# EAGLE design Laser_Array_Temp_Low_BRD_V2.3 (EAGLE 7.7.0)
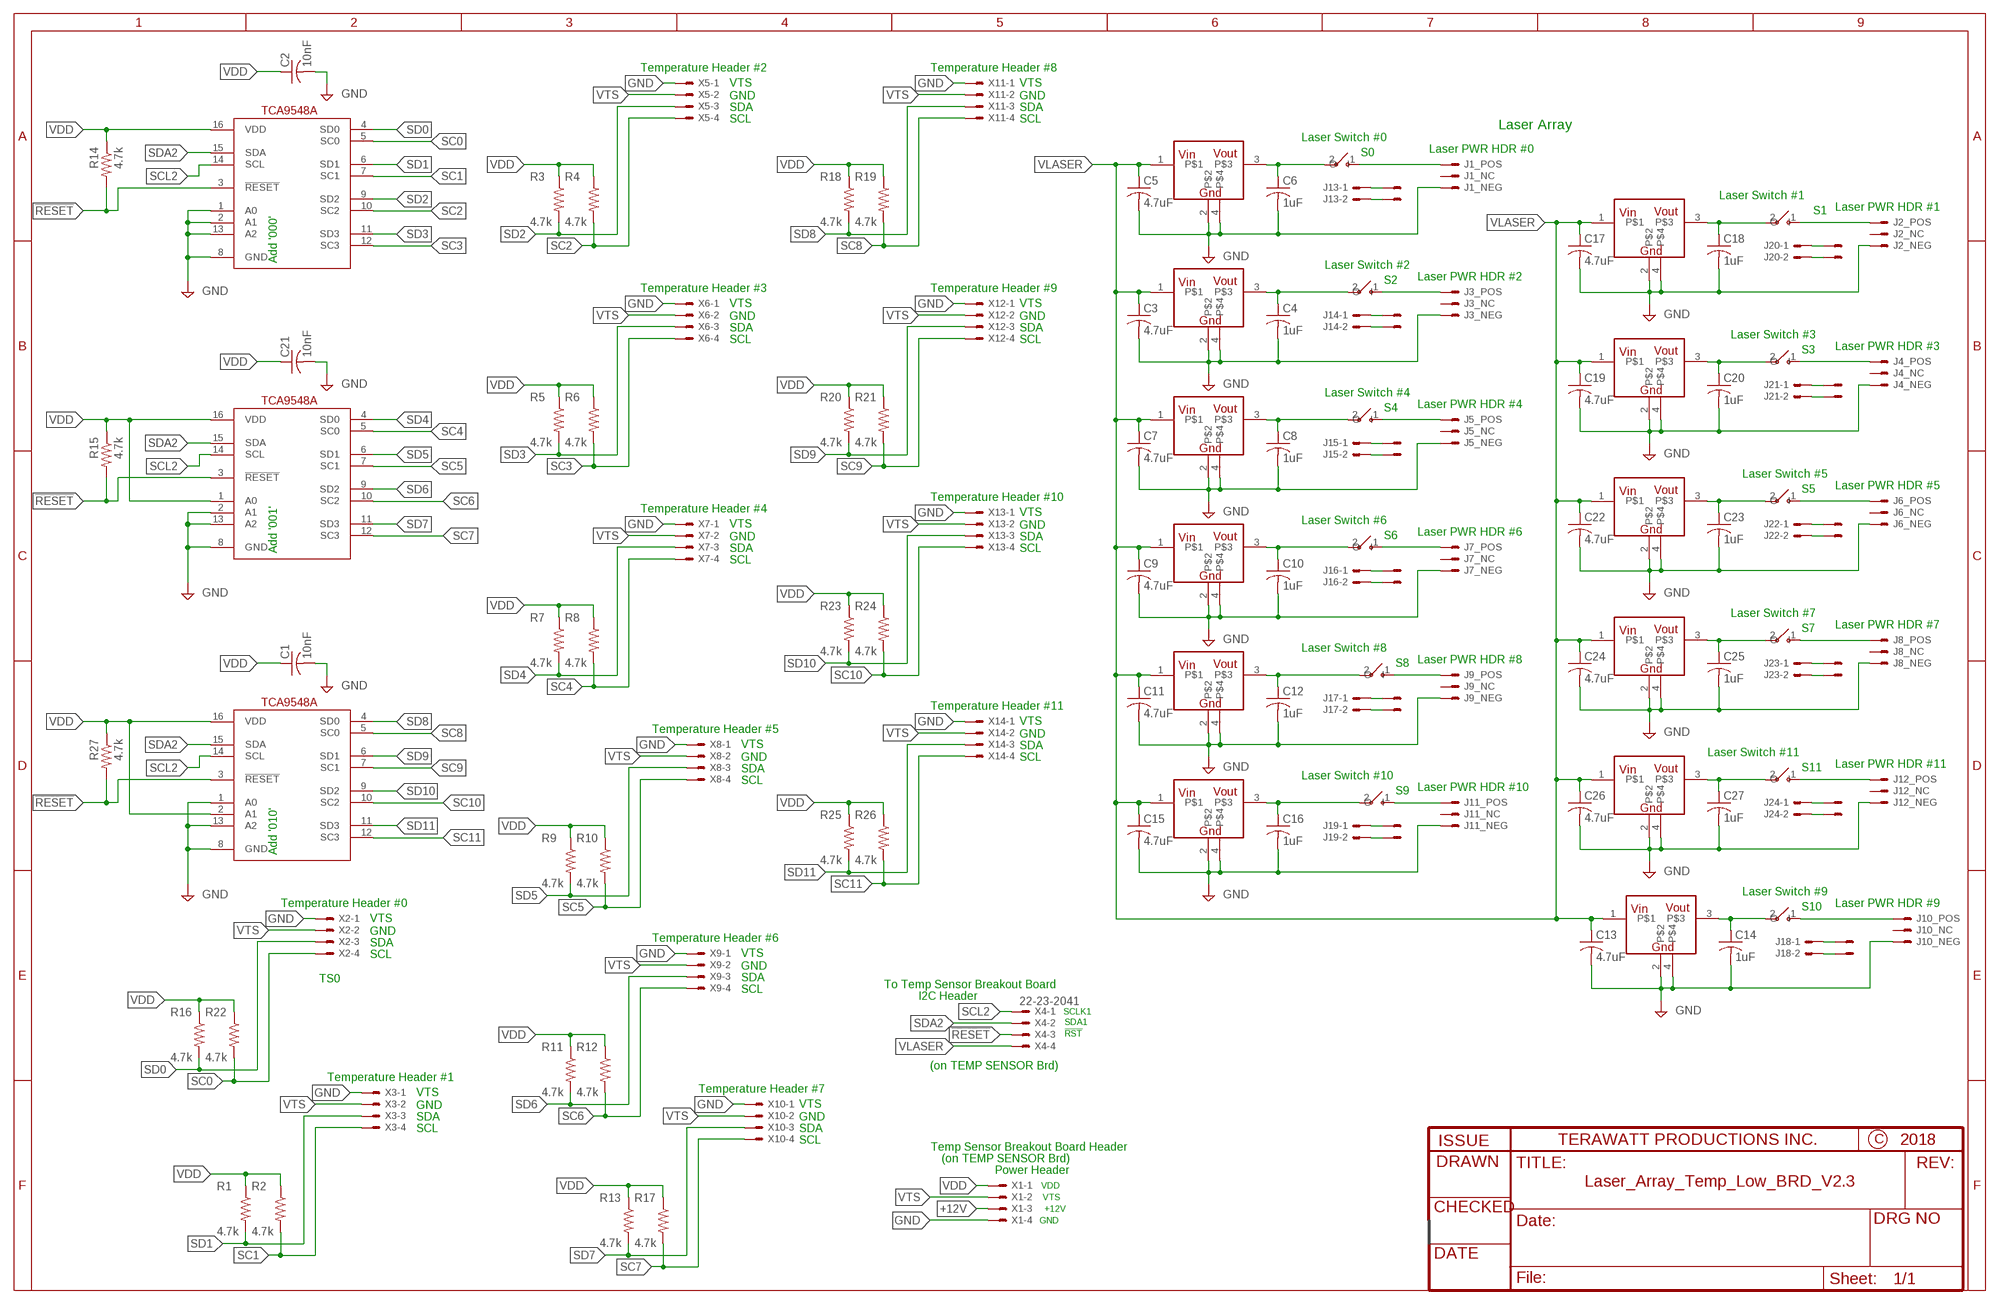
[diagram p0: schematic, sheet 1]

## Parts
C1  10nF  C-USC0805  [C0805]
C2  10nF  C-USC0805  [C0805]
C3  4.7uF  C-USC0805  [C0805]
C4  1uF  C-USC0805  [C0805]
C5  4.7uF  C-USC0805  [C0805]
C6  1uF  C-USC0805  [C0805]
C7  4.7uF  C-USC0805  [C0805]
C8  1uF  C-USC0805  [C0805]
C9  4.7uF  C-USC0805  [C0805]
C10  1uF  C-USC0805  [C0805]
C11  4.7uF  C-USC0805  [C0805]
C12  1uF  C-USC0805  [C0805]
C13  4.7uF  C-USC0805  [C0805]
C14  1uF  C-USC0805  [C0805]
C15  4.7uF  C-USC0805  [C0805]
C16  1uF  C-USC0805  [C0805]
C17  4.7uF  C-USC0805  [C0805]
C18  1uF  C-USC0805  [C0805]
C19  4.7uF  C-USC0805  [C0805]
C20  1uF  C-USC0805  [C0805]
C21  10nF  C-USC0805  [C0805]
C22  4.7uF  C-USC0805  [C0805]
C23  1uF  C-USC0805  [C0805]
C24  4.7uF  C-USC0805  [C0805]
C25  1uF  C-USC0805  [C0805]
C26  4.7uF  C-USC0805  [C0805]
C27  1uF  C-USC0805  [C0805]
J1  LASER_MOD  [LASER_MOD]
J2  LASER_MOD  [LASER_MOD]
J3  LASER_MOD  [LASER_MOD]
J4  LASER_MOD  [LASER_MOD]
J5  LASER_MOD  [LASER_MOD]
J6  LASER_MOD  [LASER_MOD]
J7  LASER_MOD  [LASER_MOD]
J8  LASER_MOD  [LASER_MOD]
J9  LASER_MOD  [LASER_MOD]
J10  LASER_MOD  [LASER_MOD]
J11  LASER_MOD  [LASER_MOD]
J12  LASER_MOD  [LASER_MOD]
J13  22-23-2021  [22-23-2021]
J14  22-23-2021  [22-23-2021]
J15  22-23-2021  [22-23-2021]
J16  22-23-2021  [22-23-2021]
J17  22-23-2021  [22-23-2021]
J18  22-23-2021  [22-23-2021]
J19  22-23-2021  [22-23-2021]
J20  22-23-2021  [22-23-2021]
J21  22-23-2021  [22-23-2021]
J22  22-23-2021  [22-23-2021]
J23  22-23-2021  [22-23-2021]
J24  22-23-2021  [22-23-2021]
R1  4.7k  R-US_M0805  [M0805]
R2  4.7k  R-US_M0805  [M0805]
R3  4.7k  R-US_M0805  [M0805]
R4  4.7k  R-US_M0805  [M0805]
R5  4.7k  R-US_M0805  [M0805]
R6  4.7k  R-US_M0805  [M0805]
R7  4.7k  R-US_M0805  [M0805]
R8  4.7k  R-US_M0805  [M0805]
R9  4.7k  R-US_M0805  [M0805]
R10  4.7k  R-US_M0805  [M0805]
R11  4.7k  R-US_M0805  [M0805]
R12  4.7k  R-US_M0805  [M0805]
R13  4.7k  R-US_M0805  [M0805]
R14  4.7k  R-US_M0805  [M0805]
R15  4.7k  R-US_M0805  [M0805]
R16  4.7k  R-US_M0805  [M0805]
R17  4.7k  R-US_M0805  [M0805]
R18  4.7k  R-US_M0805  [M0805]
R19  4.7k  R-US_M0805  [M0805]
R20  4.7k  R-US_M0805  [M0805]
R21  4.7k  R-US_M0805  [M0805]
R22  4.7k  R-US_M0805  [M0805]
R23  4.7k  R-US_M0805  [M0805]
R24  4.7k  R-US_M0805  [M0805]
R25  4.7k  R-US_M0805  [M0805]
R26  4.7k  R-US_M0805  [M0805]
R27  4.7k  R-US_M0805  [M0805]
S13  TOGGLE_SPST  [22-23-2021]
S14  TOGGLE_SPST  [22-23-2021]
S15  TOGGLE_SPST  [22-23-2021]
S16  TOGGLE_SPST  [22-23-2021]
S17  TOGGLE_SPST  [22-23-2021]
S18  TOGGLE_SPST  [22-23-2021]
S19  TOGGLE_SPST  [22-23-2021]
S20  TOGGLE_SPST  [22-23-2021]
S21  TOGGLE_SPST  [22-23-2021]
S22  TOGGLE_SPST  [22-23-2021]
S23  TOGGLE_SPST  [22-23-2021]
S24  TOGGLE_SPST  [22-23-2021]
U1  TCA9546A  [SOIC16N]
U2  TCA9546A  [SOIC16N]
U3  TCA9546A  [SOIC16N]
U4  V_REG_3.0V_1.0A  [SOT223]
U5  V_REG_3.0V_1.0A  [SOT223]
U6  V_REG_3.0V_1.0A  [SOT223]
U7  V_REG_3.0V_1.0A  [SOT223]
U8  V_REG_3.0V_1.0A  [SOT223]
U9  V_REG_3.0V_1.0A  [SOT223]
U10  V_REG_3.0V_1.0A  [SOT223]
U11  V_REG_3.0V_1.0A  [SOT223]
U12  V_REG_3.0V_1.0A  [SOT223]
U13  V_REG_3.0V_1.0A  [SOT223]
U14  V_REG_3.0V_1.0A  [SOT223]
U15  V_REG_3.0V_1.0A  [SOT223]
U$1  SINGLE_PAD  [SINGLE_PAD]
U$2  SINGLE_PAD  [SINGLE_PAD]
U$4  SINGLE_PAD  [SINGLE_PAD]
U$5  SINGLE_PAD  [SINGLE_PAD]
U$7  SINGLE_PAD  [SINGLE_PAD]
U$8  SINGLE_PAD  [SINGLE_PAD]
U$10  SINGLE_PAD  [SINGLE_PAD]
U$11  SINGLE_PAD  [SINGLE_PAD]
U$13  SINGLE_PAD  [SINGLE_PAD]
U$14  SINGLE_PAD  [SINGLE_PAD]
U$16  SINGLE_PAD  [SINGLE_PAD]
U$17  SINGLE_PAD  [SINGLE_PAD]
U$19  SINGLE_PAD  [SINGLE_PAD]
U$20  SINGLE_PAD  [SINGLE_PAD]
U$22  SINGLE_PAD  [SINGLE_PAD]
U$23  SINGLE_PAD  [SINGLE_PAD]
U$25  SINGLE_PAD  [SINGLE_PAD]
U$26  SINGLE_PAD  [SINGLE_PAD]
U$28  SINGLE_PAD  [SINGLE_PAD]
U$29  SINGLE_PAD  [SINGLE_PAD]
U$31  SINGLE_PAD  [SINGLE_PAD]
U$32  SINGLE_PAD  [SINGLE_PAD]
U$34  SINGLE_PAD  [SINGLE_PAD]
U$35  SINGLE_PAD  [SINGLE_PAD]
X1  22-23-2041  [22-23-2041]
X2  22-23-2041  [22-23-2041]
X3  22-23-2041  [22-23-2041]
X4  22-23-2041  [22-23-2041]
X5  22-23-2041  [22-23-2041]
X6  22-23-2041  [22-23-2041]
X7  22-23-2041  [22-23-2041]
X8  22-23-2041  [22-23-2041]
X9  22-23-2041  [22-23-2041]
X10  22-23-2041  [22-23-2041]
X11  22-23-2041  [22-23-2041]
X12  22-23-2041  [22-23-2041]
X13  22-23-2041  [22-23-2041]
X14  22-23-2041  [22-23-2041]

## Nets
!RESET: R14.2 R15.2 R27.2 U1.3(!RESET) U2.3(!RESET) U3.3(!RESET) X4.3
+12V: X1.3
GND: C1.2 C2.2 C3.2 C4.2 C5.2 C6.2 C7.2 C8.2 C9.2 C10.2 C11.2 C12.2 C13.2 C14.2 C15.2 C16.2 C17.2 C18.2 C19.2 C20.2 C21.2 C22.2 C23.2 C24.2 C25.2 C26.2 C27.2 J1.3 J2.3 J3.3 J4.3 J5.3 J6.3 J7.3 J8.3 J9.3 J10.3 J11.3 J12.3 U1.1(A0) U1.2(A1) U1.8(GND) U1.13(A2) U2.2(A1) U2.8(GND) U2.13(A2) U3.1(A0) U3.8(GND) U3.13(A2) U4.2 U4.4 U5.2 U5.4 U6.2 U6.4 U7.2 U7.4 U8.2 U8.4 U9.2 U9.4 U10.2 U10.4 U11.2 U11.4 U12.2 U12.4 U13.2 U13.4 U14.2 U14.4 U15.2 U15.4 X1.4 X2.1 X3.1 X5.1 X6.1 X7.1 X8.1 X9.1 X10.1 X11.1 X12.1 X13.1 X14.1
N$1: J2.1 S13.1(O)
N$2: J1.1 S16.1(O)
N$3: J3.1 S14.1(O)
N$4: J4.1 S15.1(O)
N$5: J5.1 S17.1(O)
N$6: J6.1 S18.1(O)
N$7: J7.1 S19.1(O)
N$8: J8.1 S20.1(O)
N$9: J9.1 S21.1(O)
N$10: J11.1 S23.1(O)
N$11: J10.1 S22.1(O)
N$12: J12.1 S24.1(O)
N$13: J14.1 U$4.1(S)
N$14: J13.1 U$1.1(S)
N$15: J21.1 U$10.1(S)
N$16: J15.1 U$13.1(S)
N$17: J20.1 U$7.1(S)
N$18: J22.1 U$16.1(S)
N$19: J16.1 U$19.1(S)
N$20: J13.2 U$2.1(S)
N$21: C8.1 S17.2(I) U6.3
N$22: J14.2 U$5.1(S)
N$23: C4.1 S14.2(I) U4.3
N$24: J20.2 U$8.1(S)
N$25: C20.1 S15.2(I) U12.3
N$26: J21.2 U$11.1(S)
N$27: C25.1 S20.2(I) U14.3
N$28: J15.2 U$14.1(S)
N$29: C10.1 S19.2(I) U7.3
N$30: J22.2 U$17.1(S)
N$31: C23.1 S18.2(I) U13.3
N$32: J16.2 U$20.1(S)
N$33: C12.1 S21.2(I) U8.3
N$34: J23.1 U$22.1(S)
N$35: J23.2 U$23.1(S)
N$36: C27.1 S24.2(I) U15.3
N$37: J17.1 U$25.1(S)
N$38: J17.2 U$26.1(S)
N$39: C14.1 S22.2(I) U9.3
N$40: J18.1 U$28.1(S)
N$41: J18.2 U$29.1(S)
N$43: J24.1 U$31.1(S)
N$44: J24.2 U$32.1(S)
N$46: J19.1 U$34.1(S)
N$47: J19.2 U$35.1(S)
N$48: C18.1 S13.2(I) U11.3
N$49: C16.1 S23.2(I) U10.3
N$50: C6.1 S16.2(I) U5.3
SC0: R22.2 U1.5(SC0) X2.4
SC1: R2.2 U1.7(SC1) X3.4
SC2: R4.2 U1.10(SC2) X5.4
SC3: R6.2 U1.12(SC3) X6.4
SC4: R8.2 U2.5(SC0) X7.4
SC5: R10.2 U2.7(SC1) X8.4
SC6: R12.2 U2.10(SC2) X9.4
SC7: R17.2 U2.12(SC3) X10.4
SC8: R19.2 U3.5(SC0) X11.4
SC9: R21.2 U3.7(SC1) X12.4
SC10: R24.2 U3.10(SC2) X13.4
SC11: R26.2 U3.12(SC3) X14.4
SCL2: U1.14(SCL) U2.14(SCL) U3.14(SCL) X4.1
SD0: R16.2 U1.4(SD0) X2.3
SD1: R1.2 U1.6(SD1) X3.3
SD2: R3.2 U1.9(SD2) X5.3
SD3: R5.2 U1.11(SD3) X6.3
SD4: R7.2 U2.4(SD0) X7.3
SD5: R9.2 U2.6(SD1) X8.3
SD6: R11.2 U2.9(SD2) X9.3
SD7: R13.2 U2.11(SD3) X10.3
SD8: R18.2 U3.4(SD0) X11.3
SD9: R20.2 U3.6(SD1) X12.3
SD10: R23.2 U3.9(SD2) X13.3
SD11: R25.2 U3.11(SD3) X14.3
SDA2: U1.15(SDA) U2.15(SDA) U3.15(SDA) X4.2
VDD: C1.1 C2.1 C21.1 R1.1 R2.1 R3.1 R4.1 R5.1 R6.1 R7.1 R8.1 R9.1 R10.1 R11.1 R12.1 R13.1 R14.1 R15.1 R16.1 R17.1 R18.1 R19.1 R20.1 R21.1 R22.1 R23.1 R24.1 R25.1 R26.1 R27.1 U1.16(VDD) U2.1(A0) U2.16(VDD) U3.2(A1) U3.16(VDD) X1.1
VLASER: C3.1 C5.1 C7.1 C9.1 C11.1 C13.1 C15.1 C17.1 C19.1 C22.1 C24.1 C26.1 U4.1 U5.1 U6.1 U7.1 U8.1 U9.1 U10.1 U11.1 U12.1 U13.1 U14.1 U15.1 X4.4
VTS: X1.2 X2.2 X3.2 X5.2 X6.2 X7.2 X8.2 X9.2 X10.2 X11.2 X12.2 X13.2 X14.2
Unconnected: J1.2 J2.2 J3.2 J4.2 J5.2 J6.2 J7.2 J8.2 J9.2 J10.2 J11.2 J12.2

## Notes on the sheet
- Temperature Header #2 | Temperature Header #8
- VTS | VTS
- GND | GND
- SDA | SDA
- SCL | SCL
- Laser Array
- Laser Switch #0
- Laser PWR HDR #0
- S0
- Laser Switch #1
- Laser PWR HDR #1
- S1
- Add '000'
- Laser Switch #2
- Laser PWR HDR #2
- S2
- Temperature Header #3 | Temperature Header #9
- VTS | VTS
- GND | GND
- SDA | SDA
- Laser Switch #3
- SCL | SCL
- Laser PWR HDR #3
- S3
- Laser Switch #4
- Laser PWR HDR #4
- S4
- Laser Switch #5
- Laser PWR HDR #5
- S5
- Temperature Header #10
- Temperature Header #4
- VTS
- Laser Switch #6
- VTS | GND
- Laser PWR HDR #6
- GND | SDA | S6
- Add '001' | SDA | SCL
- SCL
- Laser Switch #7
- Laser PWR HDR #7
- S7
- Laser Switch #8
- Laser PWR HDR #8
- S8
- Temperature Header #11
- VTS
- Temperature Header #5
- GND
- VTS | SDA
- Laser Switch #11
- GND | SCL
- Laser PWR HDR #11
- SDA | S11
- Laser Switch #10
- SCL
- Laser PWR HDR #10
- S9
- Add '010'
- Laser Switch #9
- Temperature Header #0 | Laser PWR HDR #9
- S10
- VTS
- GND
- Temperature Header #6
- SDA
- SCL | VTS
- GND
- TS0 | SDA
- To Temp Sensor Breakout Board
- SCL
- I2C Header
- SCLK1
- SDA1
- !RST
- (on TEMP SENSOR Brd)
- Temperature Header #1
- Temperature Header #7
- VTS
- GND | VTS
- SDA | GND
- SCL | SDA
- SCL
- Temp Sensor Breakout Board Header
- (on TEMP SENSOR Brd)
- Power Header
- VDD
- VTS
- +12V
- GND

## Library data of the parts
C1-C27 = rcl:C-US: CAPACITOR, American symbol
J1-J12 = Mine:LASER_MOD
J13-J24 = Mine:22-23-2021: .100" (2.54mm) Center Header - 2 Pin; MF: MOLEX; MPN: 22-23-2021; OC_FARNELL: 1462926; OC_NEWARK: 25C3832
R1-R27 = rcl:R-US_: RESISTOR, American symbol
S13-S24 = Mine:TOGGLE_SPST: SPST Toggle SPST toggle switch with no package
U1-U3 = Mine:TCA9546A
U4-U15 = Mine:V_REG_3.0V_1.0A: Microchip voltage regulator. 3.0V, 1.0A, SOT223-4 package, tab = gnd.
U$1 U$2 U$4 U$5 U$7 U$8 U$10 U$11 U$13 U$14 U$16 U$17 U$19 U$20 U$22 U$23 U$25 U$26 U$28 U$29 U$31 U$32 U$34 U$35 = Mine:SINGLE_PAD
X1-X14 = Mine:22-23-2041: .100" (2.54mm) Center Header - 4 Pin; MF: MOLEX; MPN: 22-23-2041; OC_FARNELL: 1462920; OC_NEWARK: 38C0355

## Net classes
0 default: width 0.254 mm, drill 0.508 mm, clearance 0.203 mm

## Board
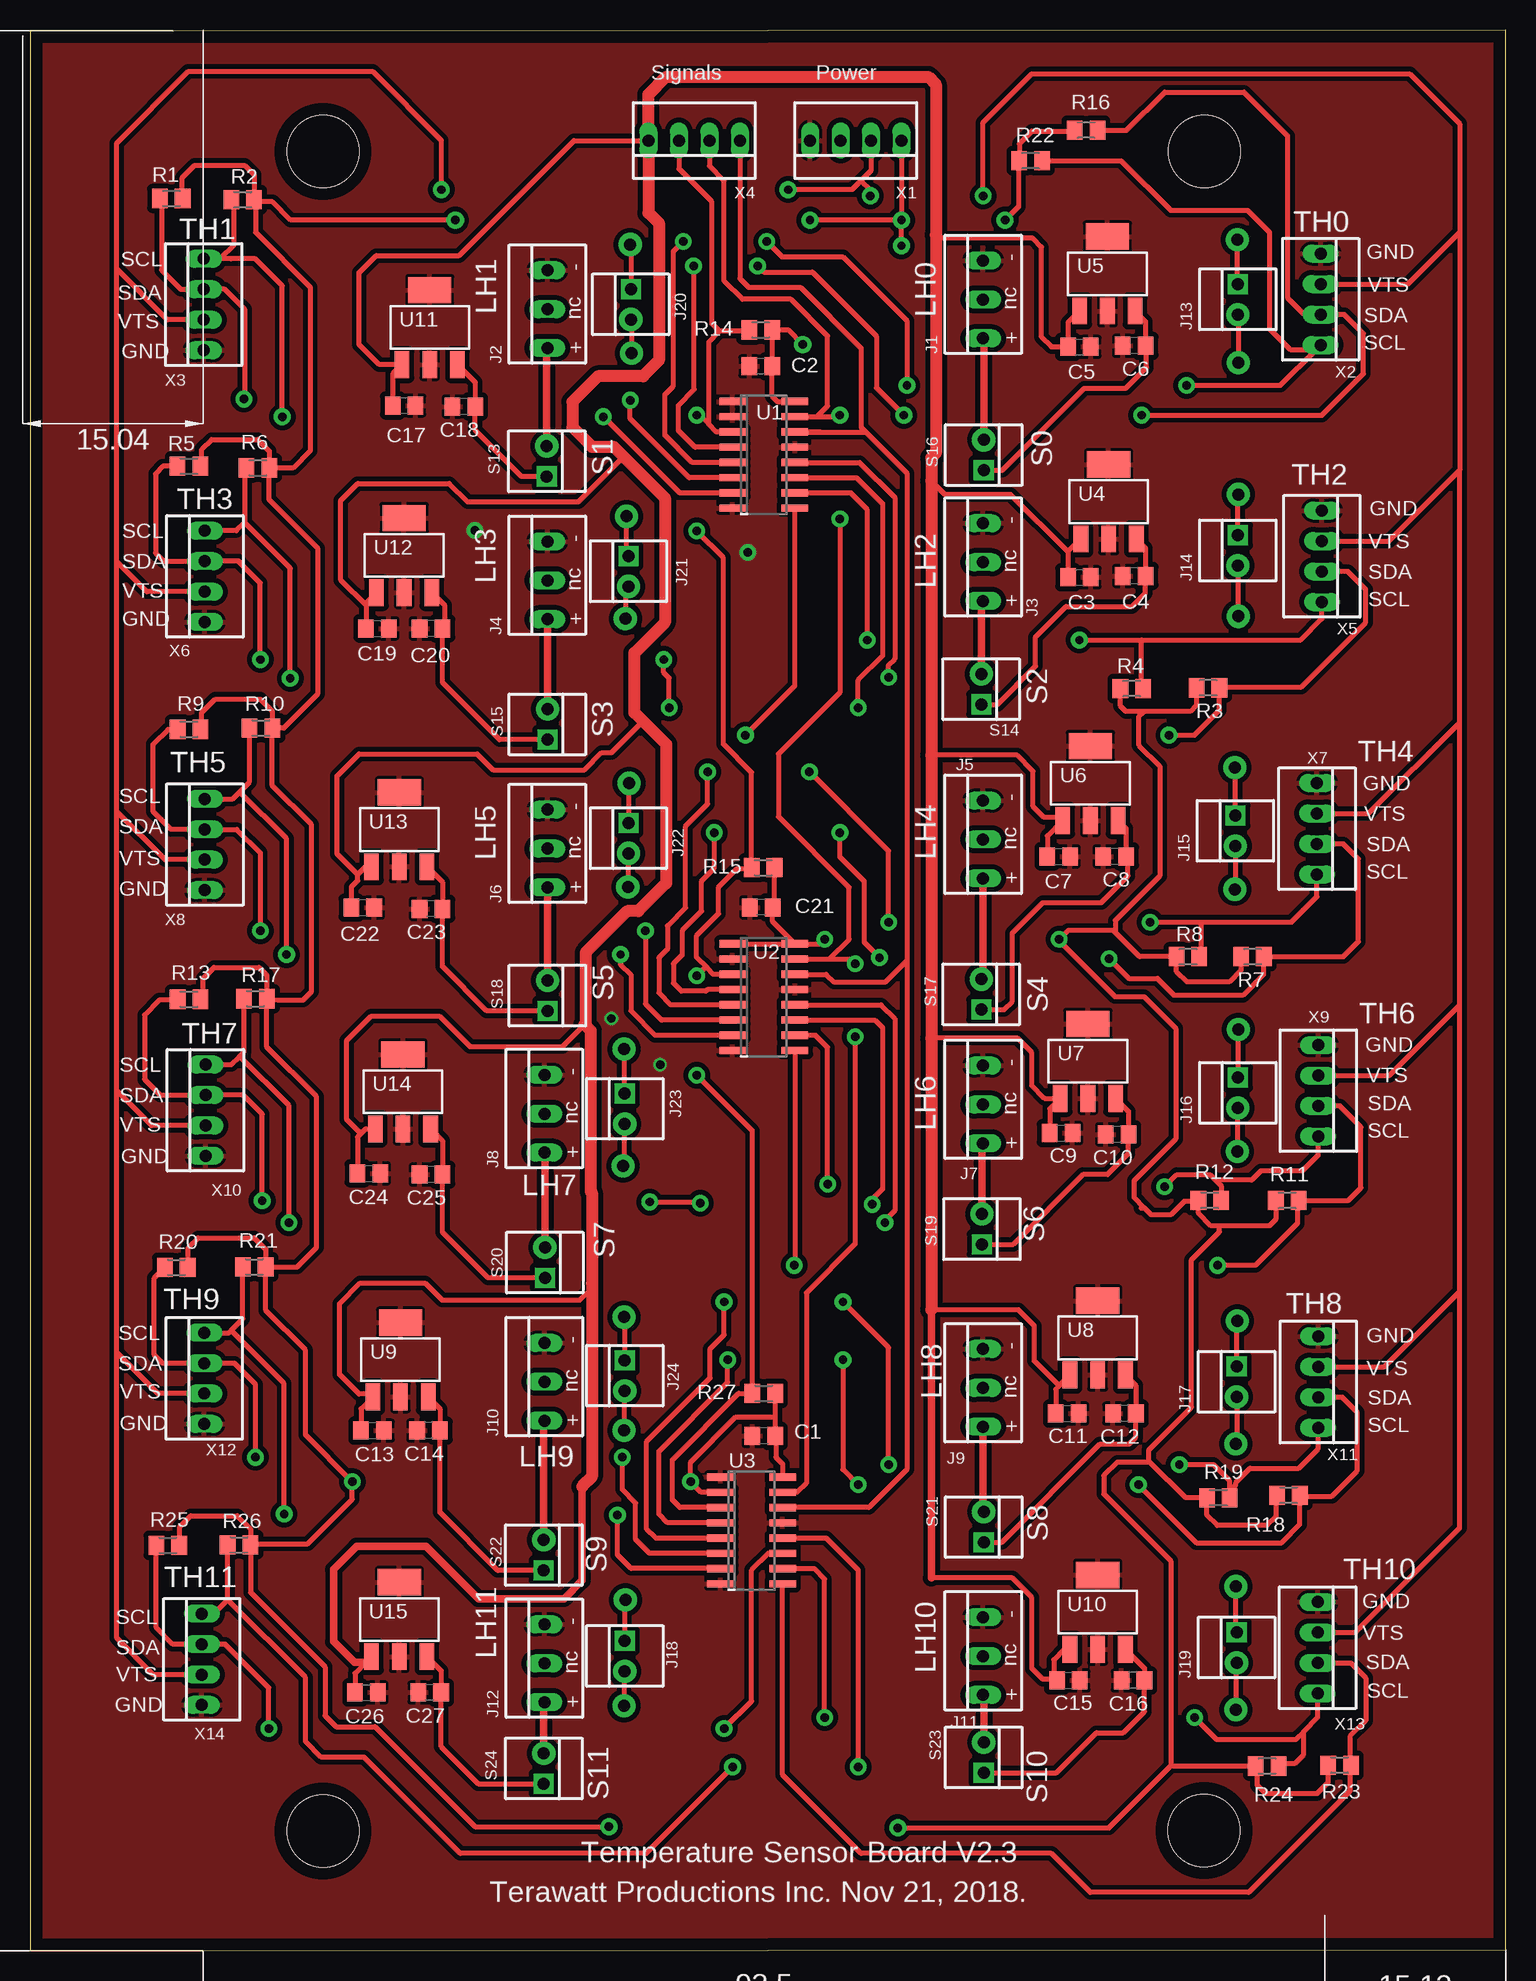
[diagram p1: board, top side]
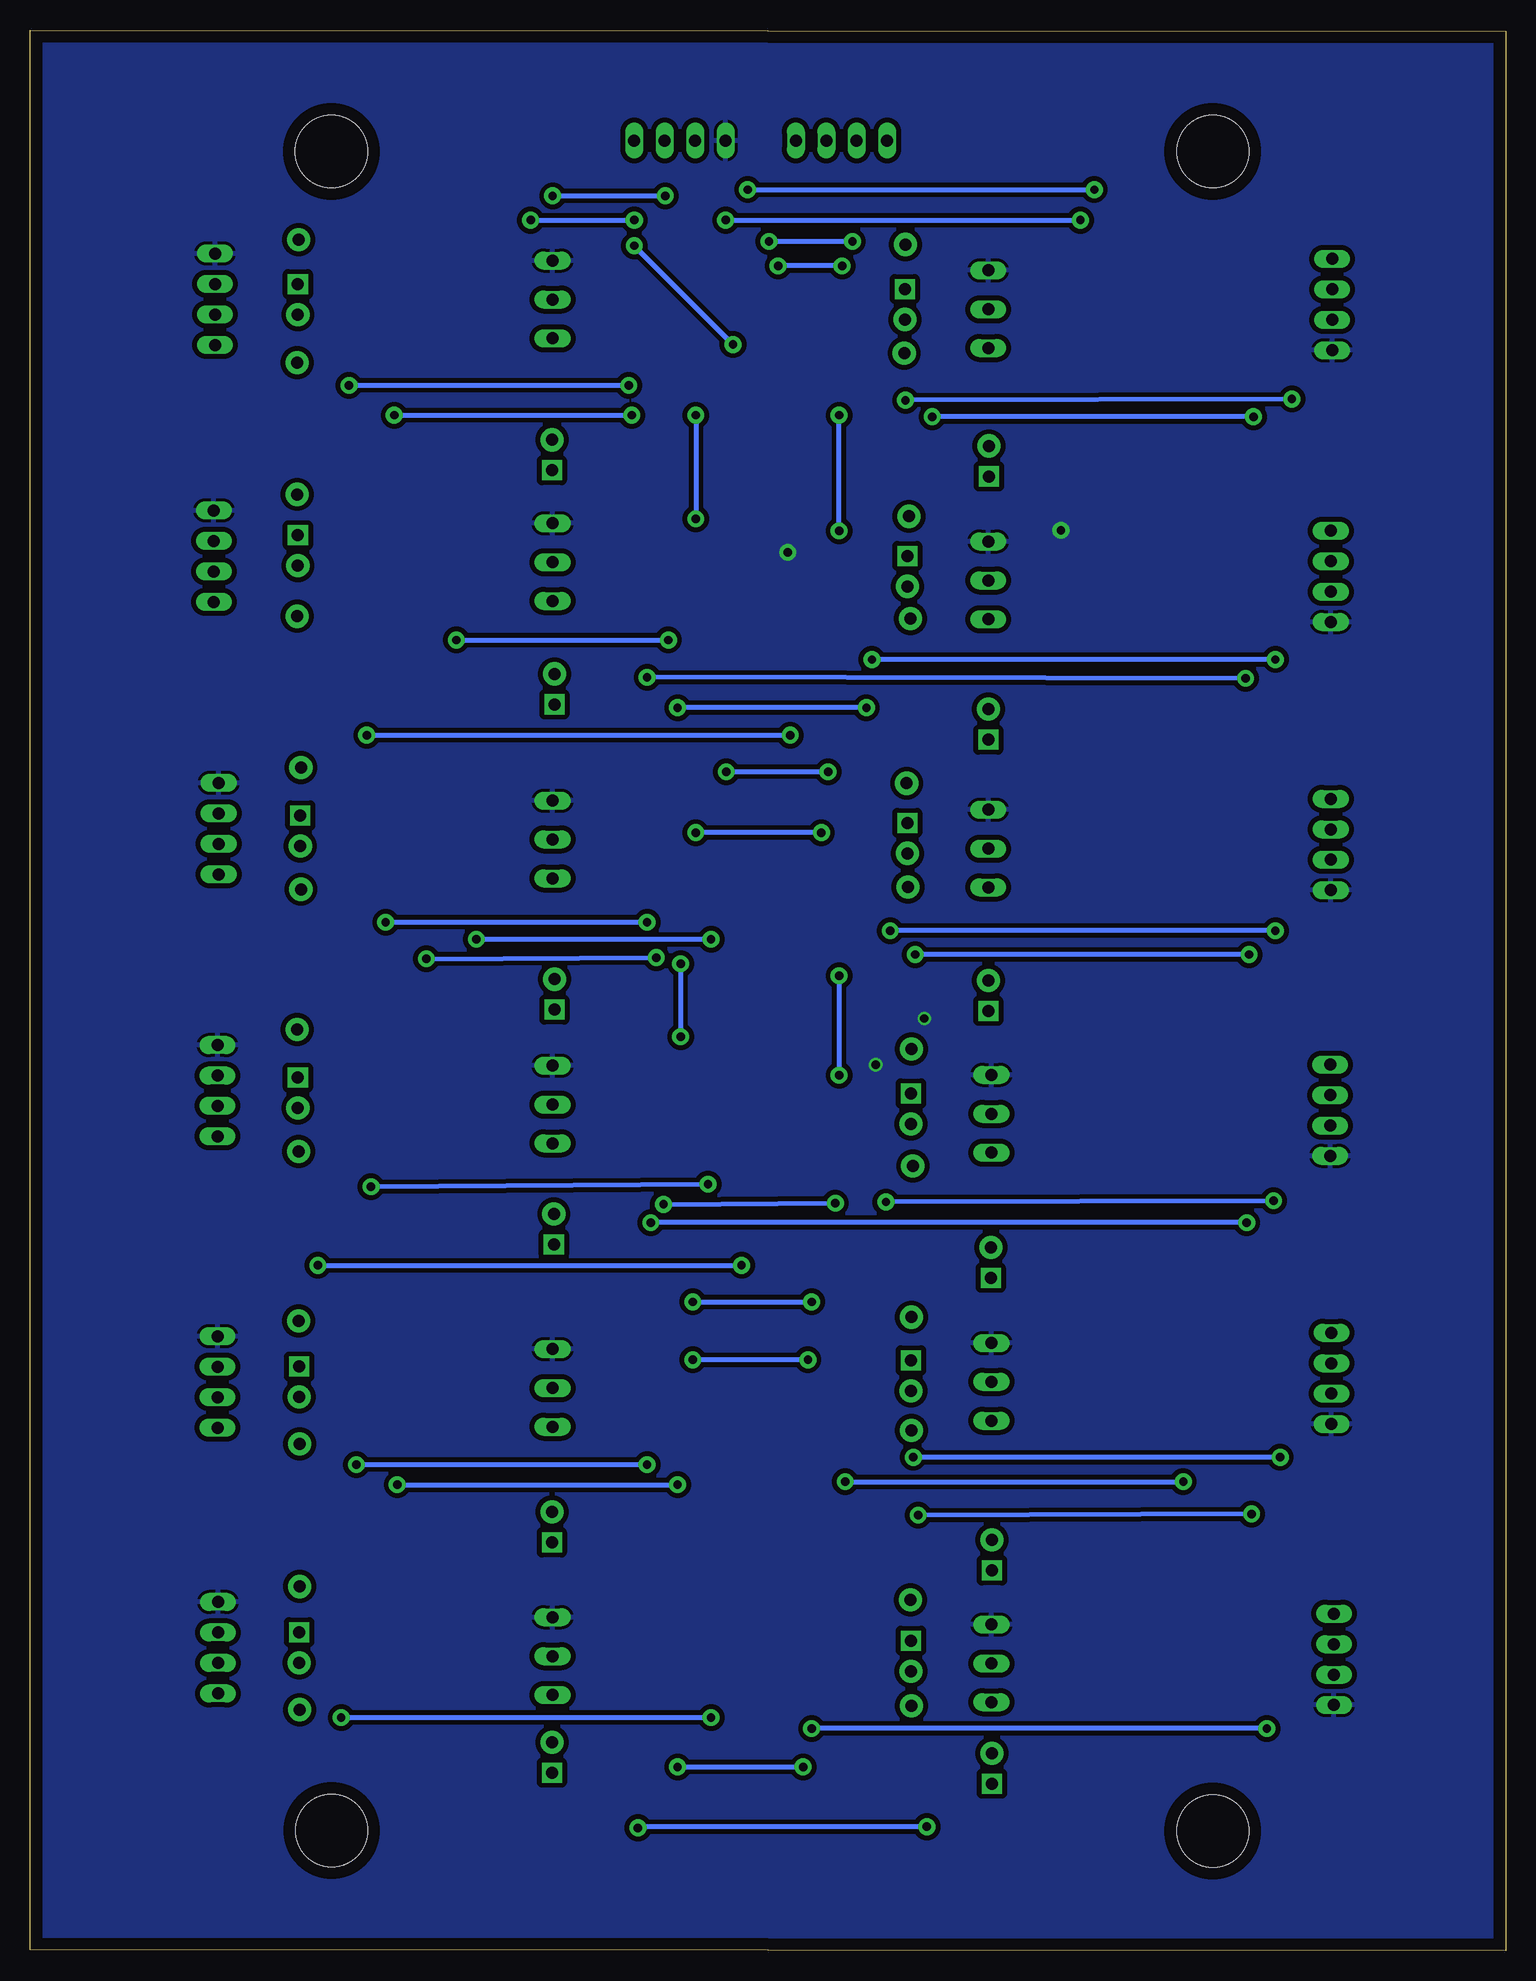
[diagram p2: board, bottom side, seen from below]

Size 123.02 x 160.12 mm. Coordinates in mm from the lower left corner, seen from the top.
Outline: 0,0 123.02,0.1 123.02,160.12 0,160.02 0,0
Copper layers (1*16): Top 0.035mm / dielectric 1.5mm / Bottom 0.035mm
Design rules "default *": minimum track width 10mil, minimum drill 24mil, track to track 16mil, track to pad 14mil, pad to pad 14mil, via to via 14mil, smd to smd 14mil, copper to edge 40mil, drill to drill 8mil, minimum pad ring 10mil, minimum via ring 8mil, stop-mask expansion 4mil, vias tented up to drill 0mil, thermal gap 10mil
Holes 5.99 mm at 24.43,10 24.43,150 97.87,10.04 97.89,150

### Footprints (pad centres in the part's own frame; a part is rotated, then mirrored left to right if it is on the bottom)
C0805 = smd 1.3 x 1.5: 1 -0.95,0; 2 0.95,0
LASER_MOD = drill 1 long: 1 -2.54,0; 2 0.7,0; 3 3.94,0
22-23-2021 = drill 1 pad 1.93: 1 -1.27,0 | drill 1 pad 1.676 square: 2 1.27,0
M0805 = smd 1.3 x 1.6: 1 -0.95,0; 2 0.95,0
SOIC16N = smd 0.6 x 2.2: 1 -4.445,-2.6; 2 -3.175,-2.6; 3 -1.905,-2.6; 4 -0.635,-2.6; 5 0.635,-2.6; 6 1.905,-2.6; 7 3.175,-2.6; 8 4.445,-2.6; 9 4.445,2.6; 10 3.175,2.6; 11 1.905,2.6; 12 0.635,2.6; 13 -0.635,2.6; 14 -1.905,2.6; 15 -3.175,2.6; 16 -4.445,2.6
SOT223 = smd 1.219 x 2.235: 1 -2.311,-3.099; 2 0,-3.099; 3 2.311,-3.099 | smd 3.6 x 2.2: 4 0,3.099
SINGLE_PAD = drill 1 pad 1.93: 1 -1.27,0
22-23-2041 = drill 1 long: 1 -3.81,0; 2 -1.27,0; 3 1.27,0; 4 3.81,0

### Placement (x,y rotation side)
C1  61.16,42.93 180 top
C2  60.91,132.08 180 top
C3  87.48,114.5 0 top
C4  92.05,114.6 180 top
C5  87.48,133.71 0 top
C6  92.05,133.81 180 top
C7  85.75,91.24 0 top
C8  90.42,91.24 180 top
C9  85.95,68.17 0 top
C10  90.63,68.07 180 top
C11  86.46,44.81 0 top
C12  91.24,44.81 180 top
C13  28.55,43.38 0 top
C14  33.22,43.38 180 top
C15  86.56,22.56 0 top
C16  91.95,22.56 180 top
C17  31.19,128.83 0 top
C18  36.17,128.73 180 top
C19  28.96,110.24 0 top
C20  33.43,110.24 180 top
C21  60.96,86.99 180 top
C22  27.74,86.97 0 top
C23  33.43,86.87 180 top
C24  28.24,64.82 0 top
C25  33.43,64.72 180 top
C26  28.04,21.54 0 top
C27  33.32,21.54 180 top
J1  79.45,136.96 90 top
J2  43.13,136.14 90 top
J3  79.45,115.06 90 top
J4  43.13,113.54 90 top
J5  79.45,91.95 90 top
J6  43.13,91.19 90 top
J7  79.45,69.85 90 top
J8  42.88,69.09 90 top
J9  79.45,46.23 90 top
J10  42.88,46.74 90 top
J11  79.45,23.88 90 top
J12  42.88,23.27 90 top
J13  100.69,137.67 90 top
J14  100.69,116.74 90 top
J15  100.48,93.37 90 top
J16  100.69,71.53 90 top
J17  100.58,47.45 90 top
J18  49.58,24.59 90 top
J19  100.58,25.3 90 top
J20  50.09,137.26 90 top
J21  49.89,115.01 90 top
J22  49.89,92.76 90 top
J23  49.58,70.21 90 top
J24  49.58,47.96 90 top
R1  11.78,146.07 180 top
R2  17.73,145.97 180 top
R3  98.2,105.28 0 top
R4  91.85,105.23 0 top
R5  13.26,123.77 180 top
R6  19,123.62 180 top
R7  101.9,82.88 0 top
R8  96.52,82.88 0 top
R9  13.26,101.83 180 top
R10  19.26,101.93 180 top
R11  104.8,62.56 0 top
R12  98.35,62.56 0 top
R13  13.26,79.33 180 top
R14  60.91,135.13 180 top
R15  61.12,90.3 180 top
R16  88.04,151.76 0 top
R17  18.8,79.38 180 top
R18  104.9,37.97 0 top
R19  99.06,37.77 0 top
R20  12.19,56.97 180 top
R21  18.7,57.02 180 top
R22  83.41,149.22 0 top
R23  109.17,15.47 0 top
R24  103.12,15.42 0 top
R25  11.48,33.81 180 top
R26  17.43,33.86 180 top
R27  61.16,46.48 180 top
S13  43.08,124.18 270 top
S14  79.3,105.18 270 top
S15  43.13,102.24 270 top
S16  79.5,124.69 270 top
S17  79.3,79.73 270 top
S18  43.13,79.63 270 top
S19  79.35,60.17 270 top
S20  42.92,57.38 270 top
S21  79.5,35.33 270 top
S22  42.83,33 270 top
S23  79.5,16.13 270 top
S24  42.83,15.22 270 top
U1  61.16,124.71 270 top
U2  61.16,79.5 270 top
U3  60.15,35.05 270 top
U4  89.92,120.8 0 top
U5  89.81,139.8 0 top
U6  88.39,97.33 0 top
U7  88.19,74.17 0 top
U8  89,51.1 0 top
U9  30.89,49.28 0 top
U10  89,28.24 0 top
U11  33.32,135.33 0 top
U12  31.19,116.33 0 top
U13  30.78,93.47 0 top
U14  31.09,71.63 0 top
U15  30.78,27.64 0 top
U$1  102.01,132.38 0 top
U$2  101.9,142.65 0 top
U$4  102.01,111.25 0 top
U$5  102.01,121.41 0 top
U$7  51.41,133.2 0 top
U$8  51.31,142.24 0 top
U$10  50.9,111.05 0 top
U$11  51,119.58 0 top
U$13  101.7,88.49 0 top
U$14  101.7,98.65 0 top
U$16  51.1,88.7 0 top
U$17  51.21,97.33 0 top
U$19  101.9,66.65 0 top
U$20  102.01,76.81 0 top
U$22  50.7,65.43 0 top
U$23  50.8,75.18 0 top
U$25  101.8,42.27 0 top
U$26  101.9,52.53 0 top
U$28  50.8,20.42 0 top
U$29  50.9,29.26 0 top
U$31  50.8,43.38 0 top
U$32  50.8,52.83 0 top
U$34  101.8,20.12 0 top
U$35  101.8,30.38 0 top
X1  68.83,150.9 180 top
X2  107.59,137.67 270 top
X3  14.48,137.24 90 top
X4  55.37,150.9 180 top
X5  107.7,116.26 270 top
X6  14.58,114.58 90 top
X7  107.29,93.55 270 top
X8  14.58,92.23 90 top
X9  107.39,71.7 270 top
X10  14.63,70.08 90 top
X11  107.39,47.42 270 top
X12  14.53,47.73 90 top
X13  107.34,25.27 270 top
X14  14.32,24.31 90 top

### Tracks (layer width: path | path; a pad name or v marks a point on that pad's centre or on a via)
!RESET  (via drill 0.7 pad 1.4)
  Top 0.406: U1.3 57.23,126.62 56.59,127.25 | 56.59,127.25 56.59,134.11 57.48,135 | R14.2 59.83,135 57.48,135 | 56.59,127.25 55.83,128.02 v55.58,128.02 | 57.48,135 56.85,135.64 56.85,145.8 54.1,148.54 X4.3 | U2.3 56.97,81.41 56.46,81.92 | 56.46,81.92 55.58,82.8 55.58,84.63 57.4,86.46 57.4,88.7 58.93,90.22 60.09,90.22 R15.2 60.17,98.23 57.81,100.58 57.81,116.13 v55.58,118.36 | U3.3 54.18,36.96 53.54,37.59 53.54,40.95 59.08,46.48 R27.2 60.21,68.36 v55.58,73 | v55.58,81.28 56.21,81.92 56.46,81.92
  Bottom 0.406: v55.58,118.36 v55.58,128.02 | v55.58,81.28 v55.58,73
GND  (via drill 0.7, 0.7 pad 1.4)
  other vias: 37.08,118.41 59.84,116.59 48.46,77.72 52.53,73.86
  pour Top: -0.71,160.3 123.44,160.55 123.44,0.46 -0.71,0.2
  pour Bottom: 0,160.6 122.58,160.96 122.58,0.86 0.25,0.51
N$1
  Top 0.61: J2.1 43.08,133.56 S13.1
N$2
  Top 0.61: S16.1 79.5,134.37 J1.1
N$3
  Top 0.61: J3.1 79.3,112.37 S14.1
N$4
  Top 0.61: J4.1 S15.1
N$5
  Top 0.61: J5.1 79.45,81.15 S17.1
N$6
  Top 0.61: J6.1 S18.1
N$7
  Top 0.61: J7.1 79.35,67.21 S19.1
N$8
  Top 0.61: J8.1 42.92,66.5 S20.1
N$9
  Top 0.61: J9.1 79.45,36.65 S21.1
N$10
  Top 0.61: J11.1 79.5,21.29 S23.1
N$11
  Top 0.61: J10.1 42.83,44.15 S22.1
N$12
  Top 0.61: J12.1 42.83,20.68 S24.1
N$13
  Top 0.406: U$4.1 100.74,115.42 J14.1
N$14
  Top 0.406: J13.1 100.74,136.35 U$1.1
N$15
  Top 0.406: J21.1 49.63,113.49 U$10.1
N$16
  Top 0.406: J15.1 100.48,88.54 U$13.1
N$17
  Top 0.406: J20.1 50.14,135.94 U$7.1
N$18
  Top 0.406: J22.1 49.84,91.44 U$16.1
N$19
  Top 0.406: U$19.1 100.69,66.7 J16.1
N$20
  Top 0.406: J13.2 100.64,138.99 U$2.1
N$21
  Top 0.406: U6.3 91.37,93.56 C8.1 91.54,91.07 91.54,89.61 89.31,87.38 84.43,87.38 81.89,84.84 81.89,79.15 81.2,78.46 S17.2
N$22
  Top 0.406: J14.2 100.69,121.36 U$5.1
N$23
  Top 0.406: U4.3 93,116.93 C4.1 92.96,114.57 92.96,113.18 91.85,112.06 86.36,112.06 83.82,109.53 83.82,107.09 80.65,103.91 S14.2
N$24
  Top 0.406: U$8.1 50.09,142.19 J20.2
N$25
  Top 0.406: U12.3 34.54,112.19 34.54,110.95 34.38,110.78 C20.1 34.38,105.73 39.14,100.97 S15.2
N$26
  Top 0.406: J21.2 49.73,116.43 U$11.1
N$27
  Top 0.406: U14.3 34.38,67.55 C25.1 34.38,59.91 36.22,58.06 37.47,56.82 38.18,56.11 S20.2
N$28
  Top 0.406: J15.2 100.48,98.6 U$14.1
N$29
  Top 0.406: U7.3 91.58,69.99 C10.1 91.54,68.04 91.54,66.45 89.81,64.72 87.78,64.72 81.97,58.9 S19.2
N$30
  Top 0.406: U$17.1 49.89,97.28 J22.2
N$31
  Top 0.406: U13.3 34.38,89.09 C23.1 34.38,82.06 38.07,78.36 S18.2
N$32
  Top 0.406: J16.2 100.74,72.85 U$20.1
N$33
  Top 0.406: U8.3 92.19,47.13 C12.1 92.19,42.81 91.64,42.27 89.21,42.27 81,34.06 S21.2
N$34
  Top 0.406: U$22.1 49.58,65.58 J23.1
N$35
  Top 0.406: U$23.1 49.53,71.53 J23.2
N$36
  Top 0.406: U15.3 34.28,23.36 C27.1 34.28,17.03 37.36,13.95 S24.2
N$37
  Top 0.406: J17.1 100.58,42.32 U$25.1
N$38
  Top 0.406: J17.2 100.58,52.48 U$26.1
N$39
  Top 0.406: U9.3 34.17,45.2 C14.1 34.17,36.54 38.99,31.73 S22.2
N$40
  Top 0.406: J18.1 49.53,23.27 U$28.1
N$41
  Top 0.406: U$29.1 49.58,29.21 J18.2
N$43
  Top 0.406: J24.1 49.53,46.63 U$31.1
N$44
  Top 0.406: U$32.1 49.58,52.78 J24.2
N$46
  Top 0.406: J19.1 100.53,23.98 U$34.1
N$47
  Top 0.406: J19.2 100.53,26.62 U$35.1
N$48
  Top 0.406: S13.2 40.97,122.91 37.12,126.76 C18.1 | 37.22,128.63 C18.1 | U11.3 37.12,130.75 C18.1
N$49
  Top 0.406: U10.3 92.9,23.56 C16.1 92.9,19.95 91.14,18.19 88.9,18.19 85.57,14.86 S23.2
N$50
  Top 0.406: U5.3 93,135.83 C6.1 93.07,133.74 93.07,131.98 91.34,130.25 87.88,130.25 81.05,123.42 S16.2
SC0  (via drill 0.7 pad 1.4)
  Top 0.406: U1.5 55.19,124.08 52.93,126.34 52.93,129.74 53.65,130.45 53.65,141.68 v54.46,142.49 | v61.42,142.49 62.69,141.22 67.77,141.22 73.1,135.89 v73.1,130.5 | 84.49,149.35 R22.2 90.96,149.22 95.1,145.09 101.5,145.09 103.33,143.26 103.33,135.23 105.08,133.48 107.21,133.48 | v96.42,130.5 104.24,130.5 107.21,133.48 | 107.21,133.48 X2.4
  Bottom 0.406: v96.42,130.5 v73.1,130.5 | v54.46,142.49 v61.42,142.49
SC1  (via drill 0.7 pad 1.4)
  Top 0.406: v47.8,127.89 54.15,121.54 U1.7 | R2.2 16.97,145.78 16.97,142.14 15.87,141.04 | 15.87,141.04 X3.4 18.77,141.04 21.03,138.79 v21.03,127.89 | 16.74,141.04 15.87,141.04
  Bottom 0.406: v21.03,127.89 v47.8,127.89
SC2  (via drill 0.7 pad 1.4)
  Top 0.406: U1.10 68.4,121.54 69.8,120.14 v69.8,109.27 | v87.48,109.27 92.66,109.27 | 92.66,109.27 105.92,109.27 107.7,111.05 X5.4 | R4.2 92.66,105.37 92.66,109.27
  Bottom 0.406: v87.48,109.27 v69.8,109.27
SC3  (via drill 0.7 pad 1.4)
  Top 0.406: U1.12 69.16,124.08 72.09,121.16 72.09,107.7 71.58,107.19 v71.58,106.17 | R6.2 17.88,123.46 17.88,119.08 | 17.88,119.08 17.2,118.39 X6.4 | 17.88,119.08 21.69,115.27 v21.69,106.07
  Bottom 0.406: v21.69,106.07 v71.58,106.17
SC4  (via drill 0.7 pad 1.4)
  Top 0.406: U2.5 53.42,78.87 52.43,79.86 52.43,82.8 53.14,83.52 53.14,85.45 54.66,86.97 54.66,93.78 56.49,95.61 v56.49,98.3 | 64.97,98.04 v64.97,98.3 71.58,91.69 v71.58,85.75 | v93.37,85.75 97.64,85.75 | 97.64,85.75 105.16,85.75 107.29,87.88 X7.4 | R8.2 97.64,83.05 97.64,85.75
  Bottom 0.406: v93.37,85.75 v71.58,85.75 | v64.97,98.3 v56.49,98.3
SC5  (via drill 0.7 pad 1.4)
  Top 0.406: U2.7 52.12,76.33 50.09,78.36 50.09,81.38 49.23,82.25 v49.23,83.06 | X8.4 16.89,96.04 17.48,96.62 | 17.48,96.62 18.31,97.45 R10.2 | v21.39,83.06 21.39,92.71 17.48,96.62
  Bottom 0.406: v21.39,83.06 v49.23,83.06
SC6  (via drill 0.7 pad 1.4)
  Top 0.406: U2.10 65.48,76.33 66.5,75.31 v66.5,63.91 | X9.4 107.39,66.34 106.07,65.02 102.62,65.02 101.85,64.26 98.81,64.26 | 99.43,62.69 R12.2 99.3,63.77 98.81,64.26 | v94.59,63.7 95.61,64.72 98.35,64.72 98.81,64.26
  Bottom 0.406: v66.5,63.91 v94.59,63.7
SC7  (via drill 0.7 pad 1.4)
  Top 0.406: U2.12 70.94,78.87 72.09,77.72 72.09,61.72 71.27,60.91 v71.27,60.71 | X10.4 16.79,73.89 17.48,74.57 | 17.48,74.57 17.85,74.95 R17.2 | v21.59,60.71 21.59,70.46 17.48,74.57
  Bottom 0.406: v21.59,60.71 v71.27,60.71
SC8  (via drill 0.7 pad 1.4)
  Top 0.406: v67.77,54.1 71.58,50.29 v71.58,40.54 | U3.5 52.15,34.42 51.41,35.15 51.41,42.47 56.69,47.75 56.69,50.19 57.86,51.36 v57.86,54.1 | 100.24,38 R19.2 99.97,37.8 99.97,38.3 | X11.4 107.39,41.86 105.77,40.23 101.7,40.23 100.48,39.01 100.48,38.81 99.97,38.3 | v95.81,40.54 98.65,40.54 99.97,39.22 99.97,38.3
  Bottom 0.406: v95.81,40.54 v71.58,40.54 | v67.77,54.1 v57.86,54.1
SC9  (via drill 0.7 pad 1.4)
  Top 0.406: U3.7 50.11,31.88 48.97,33.02 v48.97,36.32 | X12.4 16.59,51.54 16.76,51.71 | 16.76,51.71 17.75,52.7 R21.2 | v21.18,36.42 21.18,47.3 16.76,51.71
  Bottom 0.406: v21.18,36.42 v48.97,36.32
SC10  (via drill 0.7 pad 1.4)
  Top 0.406: U3.10 65.35,31.88 66.24,30.99 v66.24,19.46 | 106.17,18.29 105.51,17.63 98.91,17.63 v97.08,19.46 | 106.17,18.29 107.34,19.46 X13.4 | R24.2 104.3,15.65 105.46,15.65 106.17,16.36 106.17,18.29
  Bottom 0.406: v97.08,19.46 v66.24,19.46
SC11  (via drill 0.7 pad 1.4)
  Top 0.406: U3.12 66.37,34.42 69.04,31.75 v69.04,15.34 | v58.57,15.34 51.36,8.13 35.87,8.13 27.84,16.15 24.28,16.15 22.96,17.48 22.96,22.79 16.48,29.28 | X14.4 15.32,28.12 16.48,29.28 | 16.48,29.28 R26.2
  Bottom 0.406: v69.04,15.34 v58.57,15.34
SCL2
  Top 0.406: 65.86,126.62 U1.14 69.67,126.62 | 69.67,126.62 73.1,123.19 73.1,82.55 | U2.14 66.37,81.41 67.01,80.77 71.32,80.77 73.1,82.55 | 73.1,82.55 73.1,40.13 69.93,36.96 U3.14 | 69.67,126.62 69.29,127 69.29,133.6 64.21,138.68 59.89,138.68 59.18,139.4 X4.1
SD0  (via drill 0.7 pad 1.4)
  Top 0.406: U1.4 55.45,125.35 54.05,126.75 54.05,128.83 55.37,130.15 55.37,140.41 v55.32,140.46 | v72.85,128.02 70.56,130.3 70.56,134.62 65.23,139.95 61.16,139.95 v60.66,140.46 | R16.2 91.41,151.76 94.59,154.94 101.19,154.94 104.85,151.28 104.85,137.77 106.22,136.4 X2.3 109.58,136.4 111.15,134.82 111.15,131.47 107.7,128.02 v92.66,128.02
  Bottom 0.406: v92.66,128.02 v72.85,128.02 | v55.32,140.46 v60.66,140.46
SD1  (via drill 0.7 pad 1.4)
  Top 0.406: U1.6 54.94,122.81 50.04,127.71 v50.04,129.26 | X3.3 14.5,138.48 | v17.83,129.36 17.88,129.41 17.88,136.85 16.23,138.5 X3.3 | R1.2 10.97,145.93 10.97,140.11 12.57,138.5 X3.3
  Bottom 0.406: v17.83,129.36 v50.04,129.26
SD2  (via drill 0.7 pad 1.4)
  Top 0.406: U1.9 63.76,105.47 v59.64,101.35 | v94.95,101.35 97.08,101.35 99.15,103.41 R3.2 99.22,105.36 105.97,105.36 111.35,110.74 111.35,113.49 109.86,114.99 X5.3
  Bottom 0.406: v94.95,101.35 v59.64,101.35
SD3  (via drill 0.7 pad 1.4)
  Top 0.406: U1.11 68.91,122.81 71.07,120.65 71.07,107.95 69.04,105.92 v69.04,103.63 | v53.29,103.63 53.29,106.12 52.83,106.58 v52.83,107.64 | R5.2 12.28,123.75 11.07,123.75 10.47,123.14 10.47,116.53 11.15,115.85 X6.3 17.37,115.85 | 17.45,115.85 17.37,115.85 | v19.2,107.64 19.2,114.02 17.37,115.85
  Bottom 0.406: v19.2,107.64 v52.83,107.64 | v53.29,103.63 v69.04,103.63
SD4  (via drill 0.7 pad 1.4)
  Top 0.406: U2.4 56.46,80.14 56.34,80.01 54.31,80.01 53.65,80.67 53.65,82.3 54.36,83.01 54.36,85.04 55.98,86.67 55.98,89.2 57.05,90.27 v57.05,93.22 | v70.82,82.8 69.55,84.07 69.55,89.15 67.51,91.19 v67.51,93.22 | X7.3 109.5,92.28 110.74,91.03 110.74,84.12 109.5,82.88 R7.2 102.82,82.84 102.82,81.38 101.09,79.65 95.4,79.65 93.98,81.08 91.59,81.08 v89.97,82.7
  Bottom 0.406: v89.97,82.7 v70.82,82.8 | v57.05,93.22 v67.51,93.22
SD5  (via drill 0.7 pad 1.4)
  Top 0.406: U2.6 52.65,77.6 51.31,78.94 v51.31,85.04 | R9.2 11.51,101.83 10.26,100.58 10.26,95 11.76,93.5 X8.3 17.25,93.5 19.2,91.54 v19.2,85.04
  Bottom 0.406: v19.2,85.04 v51.31,85.04
SD6  (via drill 0.7 pad 1.4)
  Top 0.406: U2.9 63.76,57.21 v63.7,57.15 | X9.3 109.19,70.43 110.95,68.68 110.95,63.6 109.91,62.56 R11.2 105.66,62.47 105.66,60.66 102.16,57.15 v99.01,57.15
  Bottom 0.406: v99.01,57.15 v63.7,57.15
SD7  (via drill 0.7 pad 1.4)
  Top 0.406: U2.11 70.43,77.6 71.07,76.96 71.07,63.5 70.21,62.64 v70.21,62.23 | R13.2 12.23,79.25 10.77,79.25 9.55,78.03 9.55,72.64 10.85,71.35 X10.3 17.76,71.35 19.36,69.75 v19.36,62.53 | v51.66,62.43 55.78,62.43 v55.88,62.33
  Bottom 0.406: v19.36,62.53 v51.66,62.43 | v70.21,62.23 v55.88,62.33
SD8  (via drill 0.7 pad 1.4)
  Top 0.406: U3.4 53.16,35.69 52.43,36.42 52.43,41.66 58.17,47.4 v58.17,49.28 | v67.77,49.28 67.77,40.13 v69.04,38.86 | X11.3 109.4,46.15 110.64,44.91 110.64,40.03 108.51,37.9 105.93,37.9 R18.2 105.85,35.55 104.34,34.04 97.23,34.04 v92.41,38.86
  Bottom 0.406: v92.41,38.86 v69.04,38.86 | v58.17,49.28 v67.77,49.28
SD9  (via drill 0.7 pad 1.4)
  Top 0.406: U3.6 51.64,33.15 50.5,34.29 50.5,37.34 49.38,38.46 v49.38,41.15 | R20.2 10.36,56.09 10.36,49.68 11.05,49 X12.3 17.04,49 18.8,47.24 v18.8,41.15
  Bottom 0.406: v18.8,41.15 v49.38,41.15
SD10
  Top 0.406: U3.9 62.75,14.67 69.29,8.13 85.14,8.13 88.39,4.88 101.6,4.88 110.03,13.31 110.03,15.55 | X13.3 110.11,24 111.35,22.76 111.35,19.2 110.03,17.88 110.03,15.55 | 110.03,15.55 R23.2
SD11  (via drill 0.7 pad 1.4)
  Top 0.406: U3.11 61.54,33.15 60.15,31.75 60.15,20.83 v57.86,18.54 | R25.2 10.53,26.96 11.91,25.58 X14.3 16.28,25.58 19.91,21.95 v19.91,18.54
  Bottom 0.406: v19.91,18.54 v57.86,18.54
SDA2  (via drill 0.7 pad 1.4)
  Top 0.406: U3.15 63.96,38.23 64.72,38.99 64.72,54.86 68.78,58.93 v68.78,76.2 | v67.51,128.02 67.39,127.89 U1.15 65.61,127.89 66.5,128.78 66.5,134.62 63.45,137.67 59.39,137.67 57.86,139.19 57.86,147.57 56.64,148.79 X4.2 | v67.51,119.38 67.51,104.9 62.38,99.77 62.38,94.54 68.28,88.65 68.28,84.33 66.62,82.68 U2.15 68.4,82.68 v68.78,82.3
  Bottom 0.406: v67.51,128.02 v67.51,119.38 | v68.78,82.3 v68.78,76.2
VDD  (via drill 0.69 pad 1.4, 0.7 pad 1.4, 0.7 pad 1.42)
  Top 0.406: U1.16 62.31,129.16 61.86,129.61 C2.1 R14.1 63.2,135.13 v64.41,133.91 | U2.1 U2.16 | U2.16 61.91,85.8 C21.1 62.07,87.15 R15.1 | R27.1 62.11,44.5 | 62.11,44.5 C1.1 62.18,42.86 62.18,41.15 62.75,40.58 U3.16 | U3.2 55.96,38.23 v55.07,39.12 55.07,40.74 58.83,44.5 62.11,44.5 | U2.16 65.86,83.95 v66.24,84.33 | R16.1 87.01,151.69 83.52,151.69 82.46,150.64 R22.1 82.4,149.16 82.4,145.39 v81.28,144.27 | 90.87,105.26 R4.1 90.9,103.77 91.34,103.33 92.86,103.33 | R3.1 97.23,105.27 97.23,103.83 96.72,103.33 92.86,103.33 | 100.99,82.84 R7.1 100.96,81.75 99.97,80.77 96.42,80.77 95.57,81.62 R8.1 92.48,82.88 90.48,84.89 | 92.86,103.33 92.46,102.92 92.46,100.48 94.18,98.75 94.18,89.61 90.48,85.9 90.48,84.89 | 90.48,84.89 90.32,85.04 86.51,85.04 v85.8,84.33 85.8,84.18 90.42,79.55 92.86,79.55 95.5,76.91 95.5,67.67 92.05,64.21 92.05,62.79 92.91,61.92 | R11.1 103.85,60.98 103.33,60.45 99.16,60.45 | 99.16,60.45 98.45,60.45 97.4,61.5 R12.1 97.32,62.48 96.22,62.48 95.1,61.37 93.47,61.37 92.91,61.92 | R18.1 103.84,37.86 103.84,36.17 103.12,35.46 98.96,35.46 98.11,36.31 R19.1 96.34,37.77 93.37,40.74 | 93.37,40.74 90.63,40.74 89.51,39.62 89.51,38.1 95.1,32.51 95.1,15.42 | 92.61,61.92 92.91,61.92 | 93.37,40.74 93.27,40.84 93.27,41.76 96.83,45.31 96.83,57.61 99.16,59.94 99.16,60.45 | R23.1 108.2,15.45 108.2,14.02 107.29,13.11 103.02,13.11 102.31,13.82 102.31,15.28 R24.1 95.1,15.42 | R5.1 14.33,123.89 14.33,125.17 15.14,125.98 19,125.98 19.95,125.04 R6.1 | R1.1 12.7,146.11 12.7,147.83 13.72,148.84 17.88,148.84 18.68,148.05 R2.1 18.8,145.85 18.8,145.49 | R9.1 14.33,101.94 14.33,103.23 15.44,104.34 19.2,104.34 20.21,103.34 R10.1
  Top 0.406: R6.1 19.91,123.59 19.91,121.01 23.98,116.94 23.98,104.75 21.16,101.93 R10.1 | R17.1 20.69,79.25 22.76,79.25 23.47,79.96 23.47,93.88 20.21,97.14 R10.1 | R13.1 14.43,79.54 14.43,81.08 15.34,81.99 19.1,81.99 19.75,81.34 R17.1 | 18.8,145.49 18.8,143.26 23.37,138.68 23.37,125.07 21.92,123.62 R6.1 | R20.1 13.21,57.04 13.21,58.62 14.02,59.44 18.69,59.44 19.65,58.48 R21.1 | R21.1 19.67,57 22.25,57 23.88,58.62 23.88,71.22 19.75,75.35 R17.1 | R25.1 12.5,33.87 12.5,35.36 13.41,36.27 17.27,36.27 18.38,35.17 R26.1 | R21.1 19.65,53.4 22.96,50.09 22.96,43.03 v26.87,39.12 26.87,37.64 23.17,33.93 18.45,33.93 R26.1 | R26.1 18.38,29.88 24.59,23.67 24.59,19.61 25.5,18.69 28.75,18.69 37.08,10.36 v48.26,10.36 | v72.34,10.26 89.94,10.26 95.1,15.42 | X1.1 v72.64,144.27 | v72.64,144.27 v65.02,144.27 | v35.46,144.27 21.74,144.27 20.22,145.8 19.1,145.8 18.8,145.49 | v72.64,142.14 v72.64,144.27
  Bottom 0.406: v66.24,84.33 v85.8,84.33 | v55.07,39.12 v26.87,39.12 | v48.26,10.36 72.24,10.36 v72.34,10.26 | 64.41,134.01 v64.41,133.91 v72.64,142.14 | v81.28,144.27 v72.64,144.27 | v65.02,144.27 v35.46,144.27
VLASER
  Top 0.406: 75.51,143.05 75.82,142.75 83.62,142.75 84.33,142.04 84.33,134.52 85.14,133.71 C5.1 86.53,135.73 U5.1 | 86.53,116.63 81.74,121.41 76.25,121.41 75.13,122.53 | 75.13,99.67 82.3,99.67 83.62,98.35 83.62,95.4 84.53,94.49 85.83,94.49 U6.1 84.8,92.95 C7.1 | 75.13,76.1 82.3,76.1 83.52,74.88 83.52,72.14 84.58,71.07 U7.1 85,70.19 C9.1 | 75.13,53.44 82.4,53.44 83.72,52.12 83.72,49.17 85.69,47.21 85.69,47 | C11.1 85.51,46.83 85.69,47 | U10.1 86.21,25.15 85.34,24.28 85.34,22.82 | 85.34,22.82 C15.1 | 85.34,22.82 85.18,22.66 84.43,22.66 83.52,23.57 83.52,29.46 81.89,31.09 75.13,31.09 | 86.53,116.63 C3.1 | U4.1 86.53,116.63 | X4.4 45.34,150.9 35.76,141.33 28.85,141.33 27.43,139.9 27.43,133.91 29.11,132.23 U11.1 30.24,131.46 C17.1 | 28.01,112.17 28.01,112.36 U12.1 | 28.01,112.17 25.91,114.26 25.91,120.9 27.33,122.33 34.95,122.33 36.47,120.8 45.72,120.8 49.17,124.26 49.17,124.87 | 27.32,89.73 27.32,89.21 26.79,88.69 C22.1 | 27.32,89.73 25.6,91.44 25.6,97.94 27.43,99.77 37.29,99.77 38.61,98.45 46.23,98.45 47.65,99.87 48.46,99.87 51.11,102.51 | 27.74,68.28 27.3,67.83 C24.1 | 27.74,68.28 27.99,68.53 U14.1 | 27.74,68.28 27.43,68.28 26.42,69.29 26.42,75.89 28.45,77.93 34.14,77.93 36.68,75.39 44.4,75.39 46.23,77.22 46.33,77.32 | 27.32,89.73 27.96,90.37 U13.1 | 28.01,112.17 C19.1 | C13.1 27.6,45.2 U9.1 28.32,46.43 27.43,46.43 25.81,48.06 25.81,53.95 27.53,55.68 32.92,55.68 34.34,54.25 45.82,54.25 46.84,55.27 46.84,55.68 | U15.1 27.98,24.04 27.09,23.15 C26.1 | 85.69,47 U8.1
  Top 0.61: 75.13,53.44 75.13,31.09 | 46.74,63.3 46.84,63.2 | 46.03,38.71 46.03,30.89 44.5,29.36 37.39,29.36 33.02,33.73 27.23,33.73 25.3,31.8 25.3,25.81 27.06,24.04 27.98,24.04
  Top 1.016: 75.13,53.44 75.13,76.1 75.13,99.67 75.13,122.53 75.13,124.46 75.51,124.84 75.51,143.05 75.51,155.57 74.88,156.21 53.04,156.21 51.56,154.74 X4.4 51.56,144.88 52.43,144.02 52.43,132.59 51.11,131.27 47.35,131.27 45.21,129.13 45.21,127 46.84,125.37 48.67,125.37 49.17,124.87 52.93,121.11 52.93,110.74 50.39,108.2 50.39,103.23 51.11,102.51 53.04,100.58 53.04,89 50.7,86.67 49.78,86.67 46.33,83.21 46.33,77.32 | 46.23,77.22 46.74,76.71 46.74,63.3 | 46.84,63.2 46.84,55.68 46.84,39.52 46.03,38.71
VTS  (via drill 0.7 pad 1.4)
  Top 0.406: 69.29,147.57 68.53,146.81 v63.2,146.81 | 69.29,147.57 70.05,146.81 v70.05,146.3 | X1.2 70.1,148.39 69.29,147.57 | v79.45,146.3 79.45,152.4 83.52,156.46 115.01,156.46 119.18,152.3 119.18,143.26 | 119.18,143.26 119.18,123.44 | 119.18,102.41 119.18,123.44 | 119.18,102.41 111.58,94.82 X7.2 | 119.18,78.84 119.18,102.41 | 119.18,78.84 113.31,72.97 X9.2 | 119.18,54.97 119.18,35.26 113.69,29.77 113,29.08 110.46,26.54 X13.2 | 119.18,54.97 119.18,78.84 | 119.18,54.97 112.9,48.69 X11.2 | 7.21,140.21 7.21,150.67 13.21,156.67 28.55,156.67 34.29,150.93 v34.29,146.81 | 7.21,115.82 7.21,140.21 | 7.21,95 7.21,115.82 | 7.21,71.73 7.21,95 | 7.21,49.89 7.21,71.73 | 7.21,49.89 7.21,26.11 10.29,23.04 X14.2 | X3.2 11.46,135.97 7.21,140.21 | X6.2 9.73,113.31 7.21,115.82 | X8.2 11.25,90.96 7.21,95 | X10.2 10.14,68.81 7.21,71.73 | X12.2 10.64,46.46 7.21,49.89 | X2.2 114.86,138.94 119.18,143.26 | X5.2 113.26,117.53 119.18,123.44
  Bottom 0.406: v63.2,146.81 v34.29,146.81 | v79.45,146.3 v70.05,146.3

### Text on the board
tPlace: Signals | Power | TH1 | TH0 | GND | SCL | SDA | VTS | LH1 | LH0 | SDA | VTS | GND | SCL | S0 | S1 | TH2 | TH3 | GND | SCL | VTS | SDA | LH3 | LH2 | SDA | VTS | SCL | GND | S2 | S3 | TH4 | TH5 | GND | SCL | VTS | SDA | SDA | LH5 | LH4 | VTS | SCL | GND | S5 | S4 | TH6 | TH7 | GND | SCL | VTS | SDA | SDA | VTS | LH6 | SCL | GND | LH7 | S6 | S7 | TH9 | TH8 | SCL | GND | SDA | VTS | VTS | LH8 | SDA | GND | SCL | LH9 | S8 | S9 | TH10 | TH11 | LH11 | GND | SCL | VTS | SDA | LH10 | SDA | VTS | SCL | GND | S11 | S10 | Temperature Sensor Board V2.3 | Terawatt Productions Inc. Nov 21, 2018.